# EAGLE design arbotix2 (EAGLE 5.07)
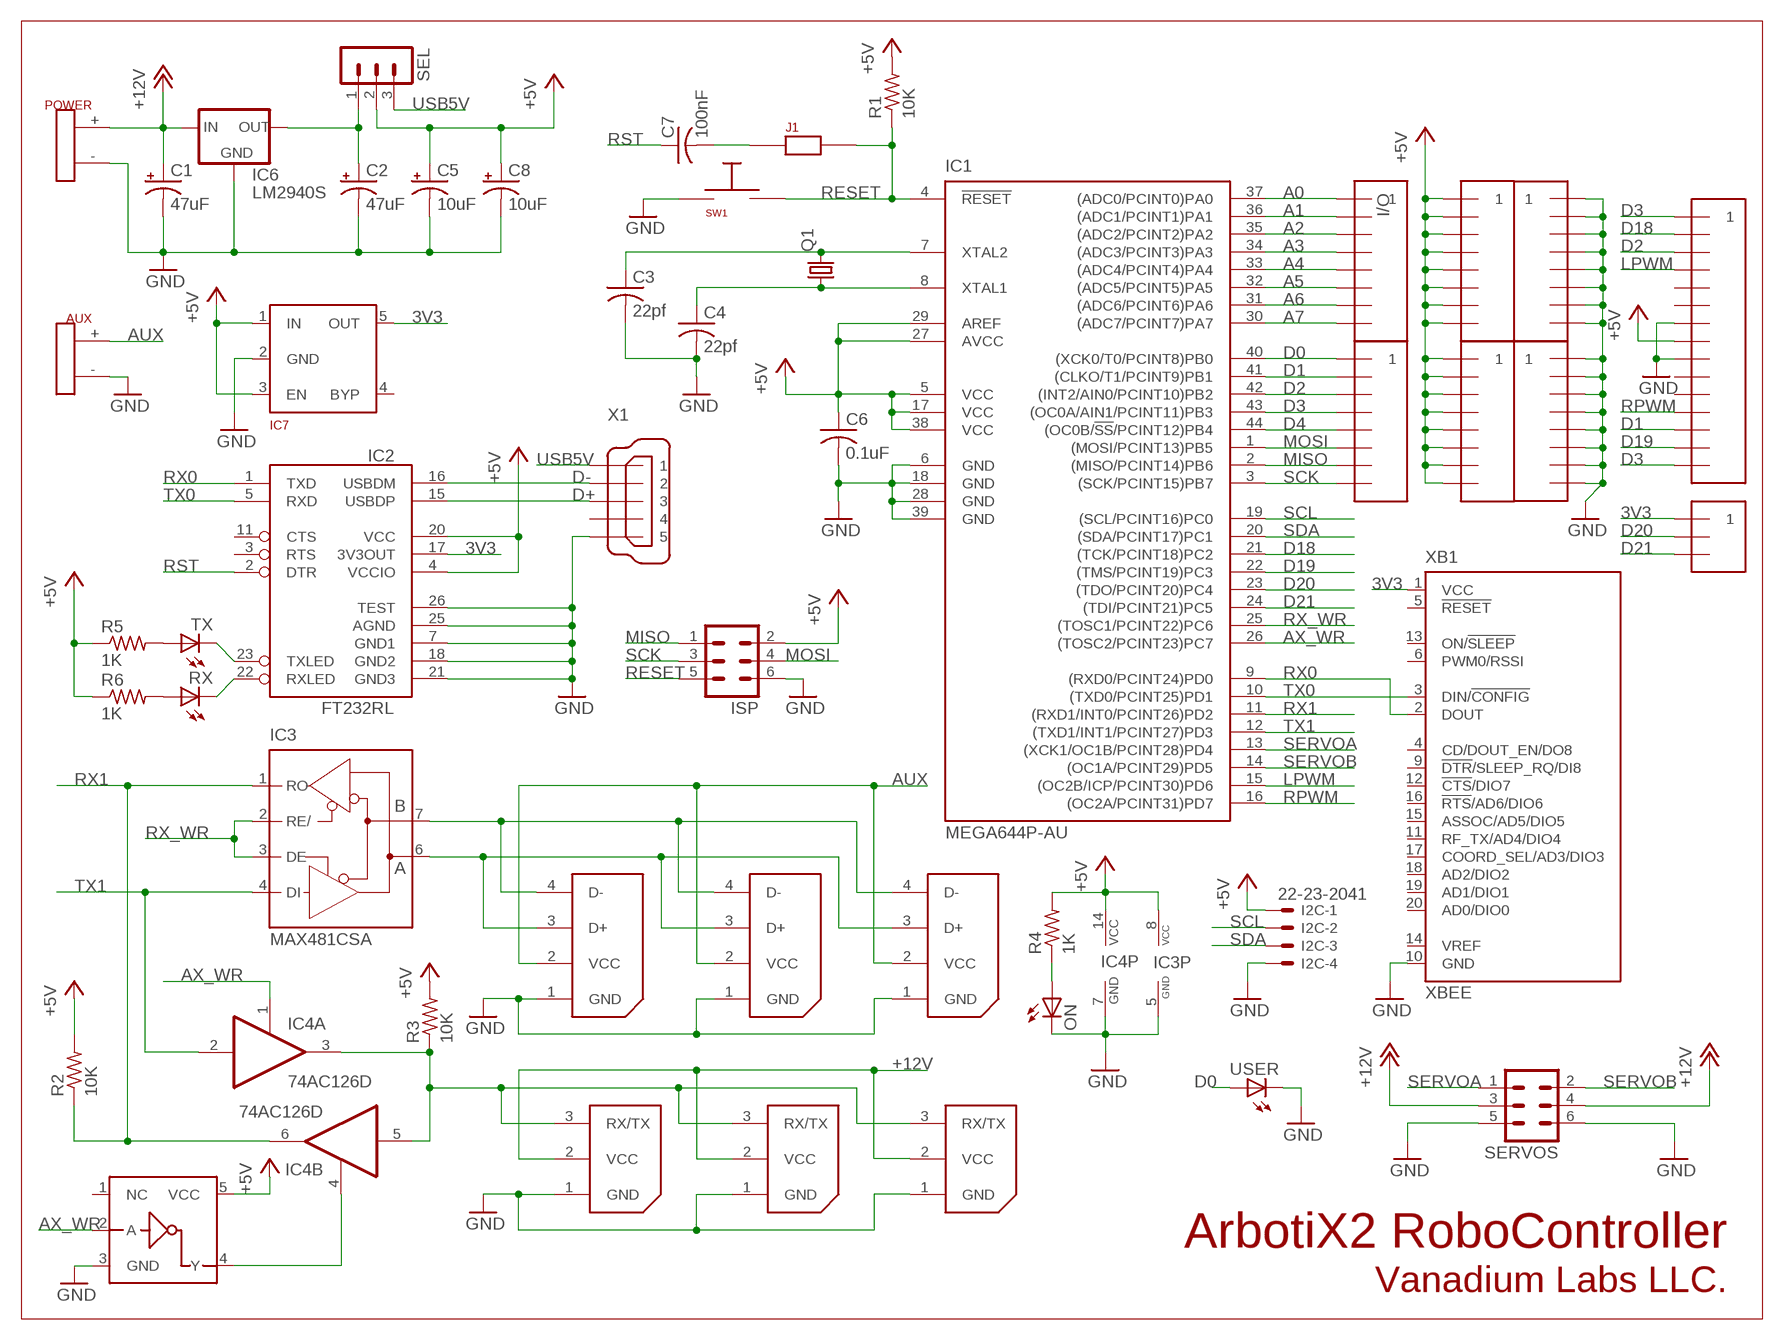
[diagram p0: schematic, sheet 1]

## Parts
AUX  POWER  [POWER]
AX1  WM18887-ND  [BIOLOID]
AX2  WM18887-ND  [BIOLOID]
AX3  WM18887-ND  [BIOLOID]
C1  47uF  CPOL-USTT2D5  [TT2D5]
C2  47uF  CPOL-USTT2D5  [TT2D5]
C3  22pf  C-USC0603  [C0603]
C4  22pf  C-USC0603  [C0603]
C5  10uF  CPOL-USTT2D5  [TT2D5]
C6  0.1uF  C-USC0603  [C0603]
C7  100nF  C-USC0603  [C0603]
C8  10uF  CPOL-USTT2D5  [TT2D5]
I2C  22-23-2041  [22-23-2041]
IC1  MEGA644P-AU  MEGA164P/324P/644P-AU  [TQFP44]
IC2  FT232RL  FT232RL-BASICSSOP  [SSOP28DB]
IC3  MAX481CSA  [SO08]
IC4  74AC126D  [SO14]
IC5  TC7S04F  [SSOP5-0.95]
IC6  LM2940S  [TO220S]
IC7  MIC5205-3.3  [SOT-23-5]
ISP  MA03-2  [MA03-2]
J1  JUMPER  [2-PIN]
ON  LEDCHIP-LED0805  [CHIP-LED0805]
POWER  POWER  [POWER]
Q1  HC49/S  [HC49/S]
R1  10K  R-US_R0805  [R0805]
R2  10K  R-US_R0805  [R0805]
R3  10K  R-US_R0805  [R0805]
R4  1K  R-US_R0805  [R0805]
R5  1K  R-US_R0603  [R0603]
R6  1K  R-US_R0603  [R0603]
RX  LEDCHIP-LED0603  [CHIP-LED0603]
RX1  RX-64  [WM18888-ND]
RX2  RX-64  [WM18888-ND]
RX3  RX-64  [WM18888-ND]
SEL  MA03-1  [MA03-1]
SERVOS  MA03-2  [MA03-2]
SW1  400-1646-ND  [MINISW]
TX  LEDCHIP-LED0603  [CHIP-LED0603]
U$1  HEADER15  [1X15]
U$3  HEADER3  [1X3]
U$5  HEADER8  [1X8]
U$6  HEADER8  [1X8]
U$8  HEADER16  [2X8]
U$9  HEADER16  [2X8]
USER  LEDCHIP-LED0805  [CHIP-LED0805]
X1  MINI-USB-UX60-MB-5ST  [UX60-MB-5ST]
XB1  XBEE  [XBEE]

## Nets
3V3: IC2.17(3V3OUT) IC7.5(OUT) U$3.P$1 XB1.1(VCC)
+5V: C5.+ C6.1 C8.+ I2C.1 IC1.5(VCC) IC1.17(VCC) IC1.27(AVCC) IC1.29(AREF) IC1.38(VCC) IC2.4(VCCIO) IC2.20(VCC) IC3.8(VCC) IC4.14(P:VCC) IC5.5(VCC) IC7.1(IN) IC7.3(EN) ISP.2 R1.2 R2.2 R3.2 R4.2 R5.1 R6.1 SEL.2 U$1.P$8 U$8.P$1 U$8.P$2 U$8.P$3 U$8.P$4 U$8.P$5 U$8.P$6 U$8.P$7 U$8.P$8 U$9.P$1 U$9.P$2 U$9.P$3 U$9.P$4 U$9.P$5 U$9.P$6 U$9.P$7 U$9.P$8
+12V: AX1.2(VCC) AX2.2(VCC) AX3.2(VCC) C1.+ IC6.1(IN) POWER.+ SERVOS.3 SERVOS.4
A0: IC1.37((ADC0/PCINT0)PA0) U$5.P$1
A1: IC1.36((ADC1/PCINT1)PA1) U$5.P$2
A2: IC1.35((ADC2/PCINT2)PA2) U$5.P$3
A3: IC1.34((ADC3/PCINT3)PA3) U$5.P$4
A4: IC1.33((ADC4/PCINT4)PA4) U$5.P$5
A5: IC1.32((ADC5/PCINT5)PA5) U$5.P$6
A6: IC1.31((ADC6/PCINT6)PA6) U$5.P$7
A7: IC1.30((ADC7/PCINT7)PA7) U$5.P$8
AUX: AUX.+ RX1.2(VCC) RX2.2(VCC) RX3.2(VCC)
AX_WR: IC1.26((TOSC2/PCINT23)PC7) IC4.1(A:OE) IC5.2(A)
D0: IC1.40((XCK0/T0/PCINT8)PB0) U$6.P$1 USER.A
D1: IC1.41((CLKO/T1/PCINT9)PB1) U$1.P$13 U$6.P$2
D2: IC1.42((INT2/AIN0/PCINT10)PB2) U$1.P$3 U$6.P$3
D3: IC1.43((OC0A/AIN1/PCINT11)PB3) U$1.P$1 U$1.P$15 U$6.P$4
D4: IC1.44((OC0B/!SS!/PCINT12)PB4) U$6.P$5
D18: IC1.21((TCK/PCINT18)PC2) U$1.P$2
D19: IC1.22((TMS/PCINT19)PC3) U$1.P$14
D20: IC1.23((TDO/PCINT20)PC4) U$3.P$2
D21: IC1.24((TDI/PCINT21)PC5) U$3.P$3
D+: IC2.15(USBDP) X1.3
D-: IC2.16(USBDM) X1.2
GND: AUX.- AX1.1(GND) AX2.1(GND) AX3.1(GND) C1.- C2.- C3.2 C4.2 C5.- C6.2 C8.- I2C.4 IC1.6(GND) IC1.18(GND) IC1.28(GND) IC1.39(GND) IC2.7(GND1) IC2.18(GND2) IC2.21(GND3) IC2.25(AGND) IC2.26(TEST) IC3.5(GND) IC4.7(P:GND) IC5.3(GND) IC6.2(GND) IC7.2(GND) ISP.6 ON.C POWER.- RX1.1(GND) RX2.1(GND) RX3.1(GND) SERVOS.5 SERVOS.6 SW1.2 U$1.P$7 U$1.P$9 U$8.P$9 U$8.P$10 U$8.P$11 U$8.P$12 U$8.P$13 U$8.P$14 U$8.P$15 U$8.P$16 U$9.P$9 U$9.P$10 U$9.P$11 U$9.P$12 U$9.P$13 U$9.P$14 U$9.P$15 U$9.P$16 USER.C X1.5 XB1.10(GND)
LPWM: IC1.15((OC2B/ICP/PCINT30)PD6) U$1.P$4
MISO: IC1.2((MISO/PCINT14)PB6) ISP.1 U$6.P$7
MOSI: IC1.1((MOSI/PCINT13)PB5) ISP.4 U$6.P$6
N$1: C3.1 IC1.7(XTAL2) Q1.2
N$2: IC3.7(B) RX1.4(D-) RX2.4(D-) RX3.4(D-)
N$3: AX1.3(RX/TX) AX2.3(RX/TX) AX3.3(RX/TX) IC4.3(A:O) IC4.5(B:I) R3.1
N$4: C4.1 IC1.8(XTAL1) Q1.1
N$7: C7.2 J1.P$1
N$8: IC4.4(B:OE) IC5.4(Y)
N$10: R6.2 RX.A
N$11: R5.2 TX.A
N$12: IC3.6(A) RX1.3(D+) RX2.3(D+) RX3.3(D+)
N$17: C2.+ IC6.3(OUT) SEL.1
N$44: IC2.23(TXLED) TX.C
N$45: IC2.22(RXLED) RX.C
N$47: ON.A R4.1
RESET: IC1.4(!RESET) ISP.5 J1.P$2 R1.1 SW1.1
RPWM: IC1.16((OC2A/PCINT31)PD7) U$1.P$12
RST: C7.1 IC2.2(DTR)
RX0: IC1.9((RXD0/PCINT24)PD0) IC2.1(TXD) XB1.2(DOUT)
RX1: IC1.11((RXD1/INT0/PCINT26)PD2) IC3.1(RO) IC4.6(B:O) R2.1
RX_WR: IC1.25((TOSC1/PCINT22)PC6) IC3.2(RE/) IC3.3(DE)
SCK: IC1.3((SCK/PCINT15)PB7) ISP.3 U$6.P$8
SCL: I2C.2 IC1.19((SCL/PCINT16)PC0)
SDA: I2C.3 IC1.20((SDA/PCINT17)PC1)
SERVOA: IC1.13((XCK1/OC1B/PCINT28)PD4) SERVOS.1
SERVOB: IC1.14((OC1A/PCINT29)PD5) SERVOS.2
TX0: IC1.10((TXD0/PCINT25)PD1) IC2.5(RXD) XB1.3(DIN/!CONFIG)
TX1: IC1.12((TXD1/INT1/PCINT27)PD3) IC3.4(DI) IC4.2(A:I)
USB5V: SEL.3 X1.1
Unconnected: IC2.3(RTS) IC2.11(CTS) IC4.8(C:O) IC4.9(C:I) IC4.10(C:OE) IC4.11(D:O) IC4.12(D:I) IC4.13(D:OE) IC5.1(NC) IC7.4(BYP) U$1.P$5 U$1.P$6 U$1.P$10 U$1.P$11 X1.4 XB1.4(CD/DOUT_EN/DO8) XB1.5(!RESET) XB1.6(PWM0/RSSI) XB1.9(!DTR!/SLEEP_RQ/DI8) XB1.11(RF_TX/AD4/DIO4) XB1.12(!CTS!/DIO7) XB1.13(ON/!SLEEP) XB1.14(VREF) XB1.15(ASSOC/AD5/DIO5) XB1.16(!RTS!/AD6/DIO6) XB1.17(COORD_SEL/AD3/DIO3) XB1.18(AD2/DIO2) XB1.19(AD1/DIO1) XB1.20(AD0/DIO0)

## Notes on the sheet
- I/O
- ArbotiX2 RoboController
- Vanadium Labs LLC.

## Library data of the parts
AUX POWER = robots:POWER
AX1-AX3 = robots:WM18887-ND: Bioloid Bus Header Digikey Part No: WM18887-ND Molex/Waldom Electronics Corp 22-03-5035
C1 C2 C5 C8 = rcl:CPOL-US: POLARIZED CAPACITOR, American symbol
C3 C4 C6 C7 = rcl:C-US: CAPACITOR, American symbol
I2C = con-molex:22-23-2041: .100" (2.54mm) Center Header - 4 Pin
IC1 = avr:MEGA164P/324P/644P-AU
IC2 = SparkFun:FT232RL-BASIC: USB UART This is the simplified version of the FT232RL unit. Only what you need, nothing you don't. Spark Fun Electronics SKU : COM-00650
IC3 = maxim:MAX481CSA: RS485 TRANSEIVER
IC4 = 74xx-eu:74*126: Quad bus BUFFER, 3-state
IC5 = robots:TC7S04F
IC6 = robots:LM2940: LM2940 LDO REGULATOR
IC7 = robots:MIC5205-3.3
ISP SERVOS = con-lstb:MA03-2: PIN HEADER
J1 = robots:JUMPER
ON RX TX USER = led:LED: LED OSRAM: - CHIPLED LG R971, LG N971, LY N971, LG Q971, LY Q971, LO R971, LY R971 LH N974, LH R974 LS Q976, LO Q976, LY Q976 LO Q996 - Hyper CHIPLED LW Q18S LB Q993, LB Q99A, LB R99A - SideLED LS A670, LO A670, LY A670, LG A670, LP A670 LB A673, LV A673, LT A673, LW A673 LH A674 LY A675 LS A676, LA A676, LO A676, LY A676, LW A676 LS A679, LY A679, LG A679 - Hyper Micro SIDELED® LS Y876, LA Y876, LO Y876, LY Y876 LT Y87S - SmartLED LW L88C, LW L88S LB L89C, LB L89S, LG L890 LS L89K, LO L89K, LY L89K LS L896, LA L896, LO L896, LY L896 - TOPLED LS T670, LO T670, LY T670, LG T670, LP T670 LSG T670, LSP T670, LSY T670, LOP T670, LYG T670 LG T671, LOG T671, LSG T671 LB T673, LV T673, LT T673, LW T673 LH T674 LS T676, LA T676, LO T676, LY T676, LB T676, LH T676, LSB T676, LW T676 LB T67C, LV T67C, LT T67C, LS T67K, LO T67K, LY T67K, LW E67C LS E67B, LA E67B, LO E67B, LY E67B, LB E67C, LV E67C, LT E67C LW T67C LS T679, LY T679, LG T679 LS T770, LO T770, LY T770, LG T770, LP T770 LB T773, LV T773, LT T773, LW T773 LH T774 LS E675, LA E675, LY E675, LS T675 LS T776, LA T776, LO T776, LY T776, LB T776 LHGB T686 LT T68C, LB T68C - Hyper Mini TOPLED® LB M676 - Mini TOPLED Santana® LG M470 LS M47K, LO M47K, LY M47K Source: http://www.osram.convergy.de LUXEON: - LUMILED® LXK2-PW12-R00, LXK2-PW12-S00, LXK2-PW14-U00, LXK2-PW14-V00 LXK2-PM12-R00, LXK2-PM12-S00, LXK2-PM14-U00 LXK2-PE12-Q00, LXK2-PE12-R00, LXK2-PE12-S00, LXK2-PE14-T00, LXK2-PE14-U00 LXK2-PB12-K00, LXK2-PB12-L00, LXK2-PB12-M00, LXK2-PB14-N00, LXK2-PB14-P00, LXK2-PB14-Q00 LXK2-PR12-L00, LXK2-PR12-M00, LXK2-PR14-Q00, LXK2-PR14-R00 LXK2-PD12-Q00, LXK2-PD12-R00, LXK2-PD12-S00 LXK2-PH12-R00, LXK2-PH12-S00 LXK2-PL12-P00, LXK2-PL12-Q00, LXK2-PL12-R00 Source: www.luxeon.com KINGBRIGHT: KA-3528ASYC Source: www.kingbright.com
Q1 = crystal:HC49/S: CRYSTAL
R1-R6 = rcl:R-US_: RESISTOR, American symbol
RX1-RX3 = robots:RX-64
SEL = con-lstb:MA03-1: PIN HEADER
SW1 = robots:400-1646-ND: Mini Switch
U$1 = robots:HEADER15
U$3 = robots:HEADER3
U$5 U$6 = robots:HEADER8
U$8 U$9 = robots:HEADER16
X1 = con-hirose:MINI-USB-: MINI USB Connector Source: http://www.hirose.co.jp/cataloge_hp/e24000019.pdf
XB1 = maxstream:XBEE: XBee (TM) /XBee-PRO(TM) OEM RF Modules Source: MaxStream, Inc. xbee_productmanual.pdf

## Board
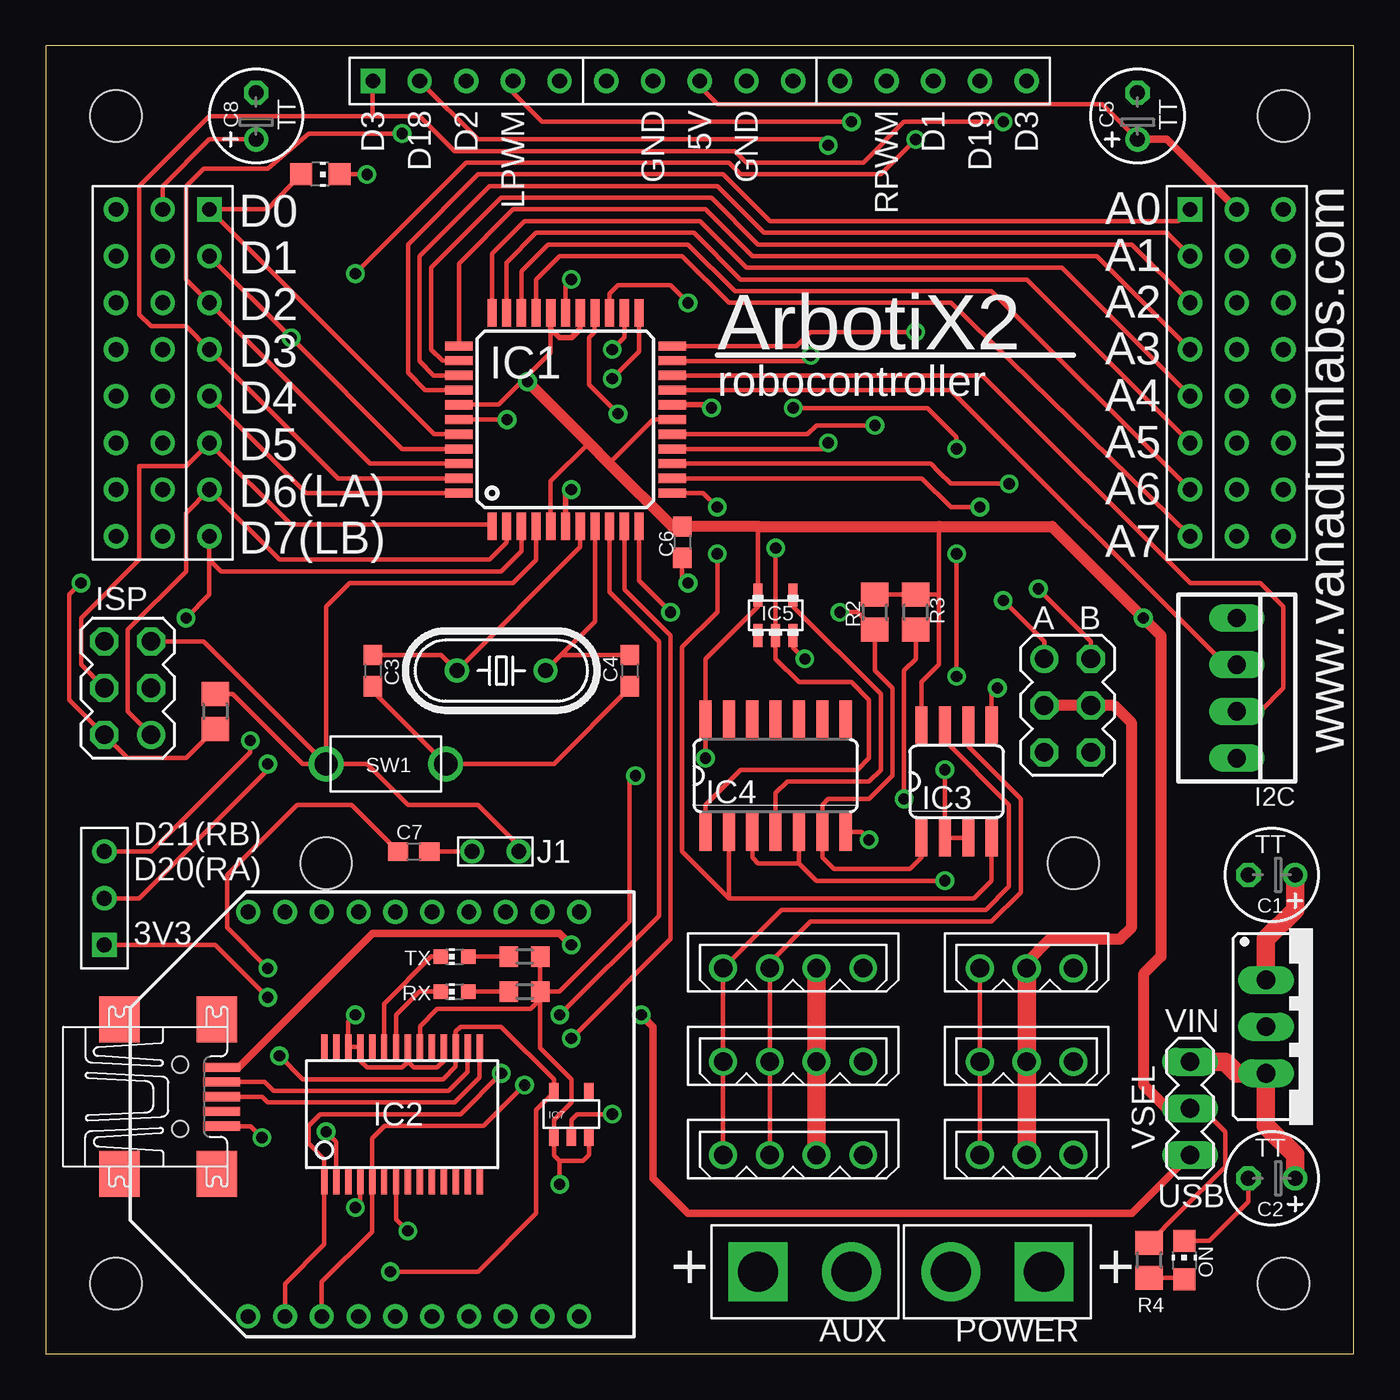
[diagram p1: board, top side]
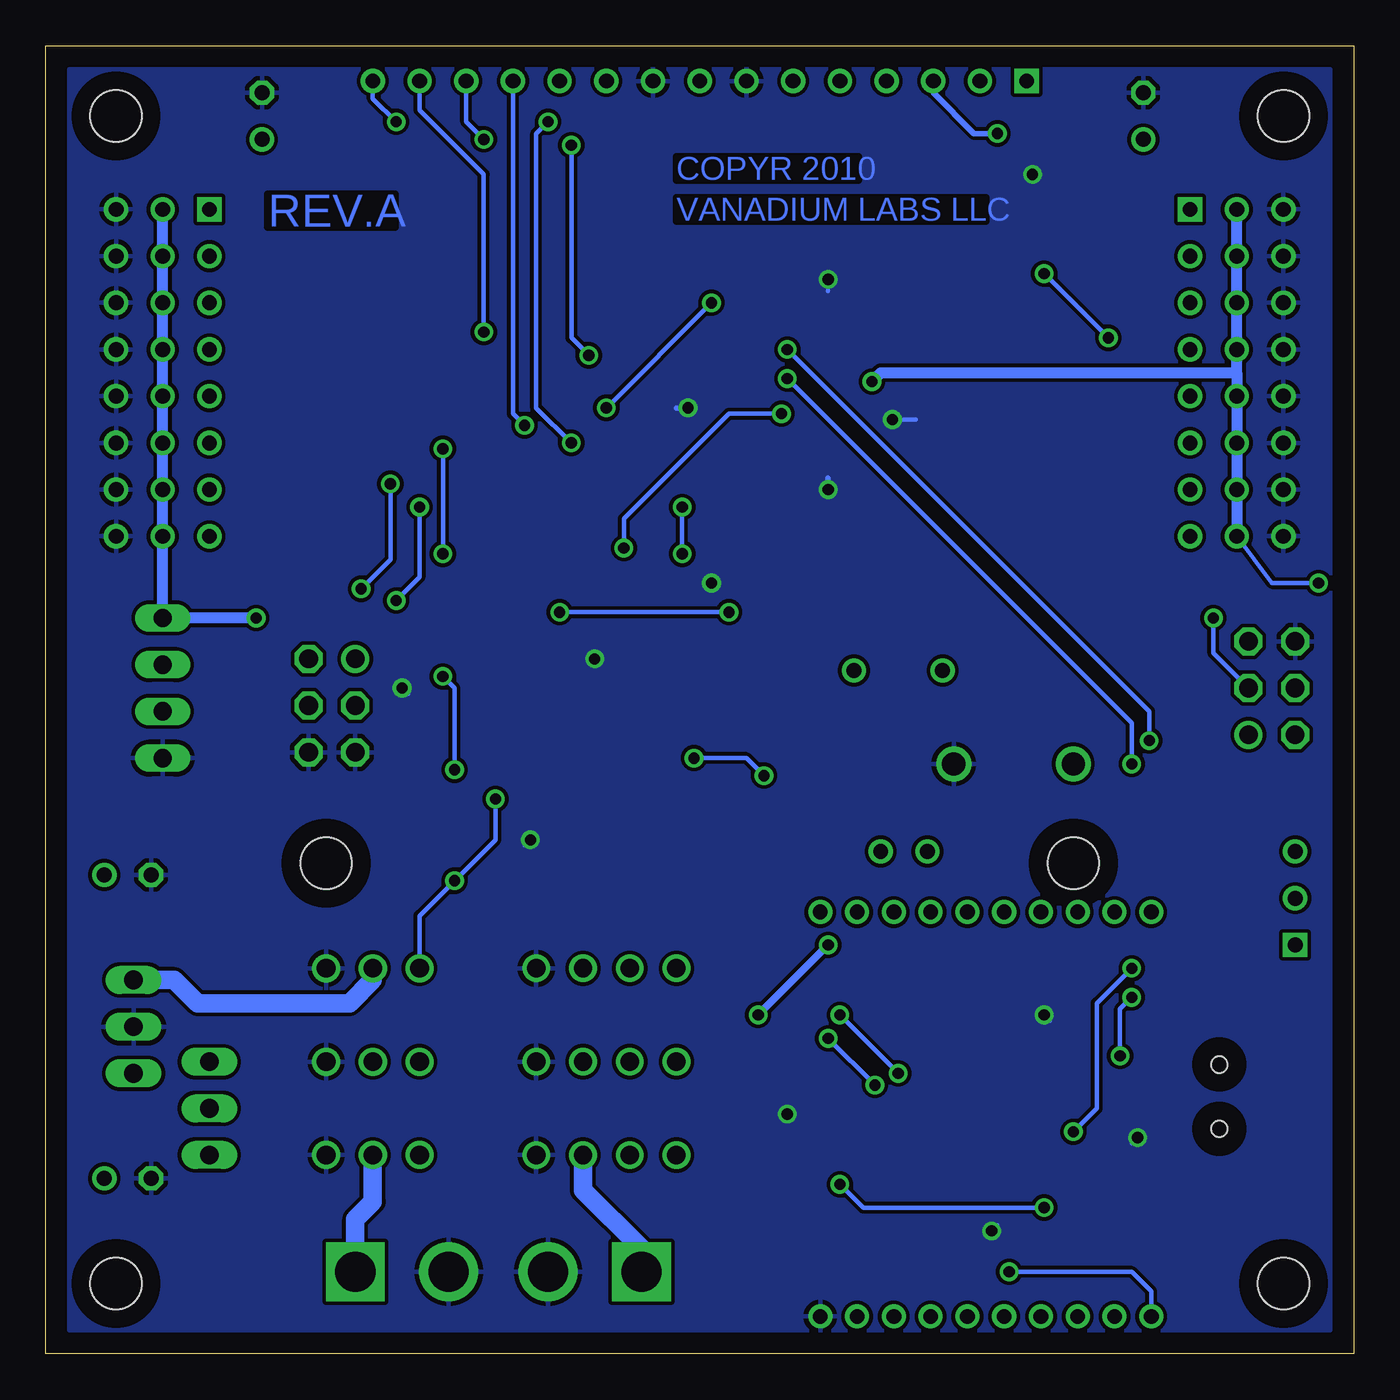
[diagram p2: board, bottom side, seen from below]

Size 71.12 x 71.12 mm. Coordinates in mm from the lower left corner, seen from the top.
Outline: 0,0 71.12,0 71.12,71.12 0,71.12 0,0
Copper layers (1*16): Top 0.035mm / dielectric 1.5mm / Bottom 0.035mm
Design rules "default *": minimum track width 8mil, minimum drill 24mil, track to track 8mil, track to pad 8mil, pad to pad 8mil, via to via 8mil, smd to smd 8mil, copper to edge 40mil, drill to drill 8mil, minimum pad ring 10mil, minimum via ring 8mil, stop-mask expansion 4mil, vias tented up to drill 24mil, thermal gap 10mil
Holes 2.79 mm at 67.31,3.81 3.81,3.81 3.81,67.31 67.31,67.31
Holes 2.8 mm at 15.24,26.67 55.88,26.67

### Footprints (pad centres in the part's own frame; a part is rotated, then mirrored left to right if it is on the bottom)
POWER = drill 2.184 square: + 0,0 | drill 2.184 round: - 5.08,0
BIOLOID = drill 1.016 round: 1 0,0; 2 2.54,0; 3 5.08,0
TT2D5 = drill 0.813 round: + -1.27,0 | drill 0.813 octagon: - 1.27,0
C0603 = smd 1.1 x 1: 1 -0.85,0; 2 0.85,0
22-23-2041 = drill 1 long: 1 -3.81,0; 2 -1.27,0; 3 1.27,0; 4 3.81,0
TQFP44 = smd 1.5 x 0.5: 1 -5.8,4; 2 -5.8,3.2; 3 -5.8,2.4; 4 -5.8,1.6; 5 -5.8,0.8; 6 -5.8,0; 7 -5.8,-0.8; 8 -5.8,-1.6; 9 -5.8,-2.4; 10 -5.8,-3.2; 11 -5.8,-4; 23 5.8,-4; 24 5.8,-3.2; 25 5.8,-2.4; 26 5.8,-1.6; 27 5.8,-0.8; 28 5.8,0; 29 5.8,0.8; 30 5.8,1.6; 31 5.8,2.4; 32 5.8,3.2; 33 5.8,4 | smd 0.5 x 1.5: 12 -4,-5.8; 13 -3.2,-5.8; 14 -2.4,-5.8; 15 -1.6,-5.8; 16 -0.8,-5.8; 17 0,-5.8; 18 0.8,-5.8; 19 1.6,-5.8; 20 2.4,-5.8; 21 3.2,-5.8; 22 4,-5.8; 34 4,5.8; 35 3.2,5.8; 36 2.4,5.8; 37 1.6,5.8; 38 0.8,5.8; 39 0,5.8; 40 -0.8,5.8; 41 -1.6,5.8; 42 -2.4,5.8; 43 -3.2,5.8; 44 -4,5.8
SSOP28DB = smd 0.348 x 1.397: 1 -4.225,-3.656; 2 -3.575,-3.656; 3 -2.925,-3.656; 4 -2.275,-3.656; 5 -1.625,-3.656; 6 -0.975,-3.656; 7 -0.325,-3.656; 8 0.325,-3.656; 9 0.975,-3.656; 10 1.625,-3.656; 11 2.275,-3.656; 12 2.925,-3.656; 13 3.575,-3.656; 14 4.225,-3.656; 15 4.225,3.656; 16 3.575,3.656; 17 2.925,3.656; 18 2.275,3.656; 19 1.625,3.656; 20 0.975,3.656; 21 0.325,3.656; 22 -0.325,3.656; 23 -0.975,3.656; 24 -1.625,3.656; 25 -2.275,3.656; 26 -2.925,3.656; 27 -3.575,3.656; 28 -4.225,3.656
SO08 = smd 0.66 x 2.032: 1 -1.905,-3.073; 2 -0.635,-3.073; 3 0.635,-3.073; 4 1.905,-3.073; 5 1.905,3.073; 6 0.635,3.073; 7 -0.635,3.073; 8 -1.905,3.073
SO14 = smd 0.66 x 2.032: 1 -3.81,-3.073; 2 -2.54,-3.073; 3 -1.27,-3.073; 4 0,-3.073; 5 1.27,-3.073; 6 2.54,-3.073; 7 3.81,-3.073; 8 3.81,3.073; 9 2.54,3.073; 10 1.27,3.073; 11 0,3.073; 12 -1.27,3.073; 13 -2.54,3.073; 14 -3.81,3.073
SSOP5-0.95 = smd 1.27 x 0.5: 1 0,0; 2 0,-0.95; 3 0,-1.9; 4 2.2,-1.9; 5 2.2,0
TO220S = drill 1.016 long: 1 -2.54,1.27; 2 0,1.27; 3 2.54,1.27
SOT-23-5 = smd 0.508 x 1.016: 1 -0.95,-1.2; 2 0,-1.2; 3 0.95,-1.2; 4 0.95,1.2; 5 -0.95,1.2
MA03-2 = drill 1.016 round: 1 -2.54,-1.27 | drill 1.016 octagon: 2 -2.54,1.27; 3 0,-1.27; 4 0,1.27; 5 2.54,-1.27; 6 2.54,1.27
2-PIN = drill 0.813 round: P$1 -1.27,0; P$2 1.27,0
CHIP-LED0805 = smd 1.2 x 1.2: A 0,-1.05; C 0,1.05
HC49/S = drill 0.813 round: 1 -2.413,0; 2 2.413,0
R0805 = smd 1.3 x 1.5: 1 -0.95,0; 2 0.95,0
R0603 = smd 1 x 1.1: 1 -0.85,0; 2 0.85,0
CHIP-LED0603 = smd 0.8 x 0.8: A 0,-0.75; C 0,0.75
WM18888-ND = drill 1 round: 1 0,0; 2 -2.54,0; 3 -5.08,0; 4 -7.62,0
MA03-1 = drill 1.016 long: 1 -2.54,0; 2 0,0; 3 2.54,0
MINISW = drill 1.27 round: 1 0,0; 2 6.5,0
1X15 = drill 0.813 square: P$1 0,0 | drill 0.813 round: P$2 2.54,0; P$3 5.08,0; P$4 7.62,0; P$5 10.16,0; P$6 12.7,0; P$7 15.24,0; P$8 17.78,0; P$9 20.32,0; P$10 22.86,0; P$11 25.4,0; P$12 27.94,0; P$13 30.48,0; P$14 33.02,0; P$15 35.56,0
1X3 = drill 0.813 square: P$1 0,0 | drill 0.813 round: P$2 2.54,0; P$3 5.08,0
1X8 = drill 0.813 square: P$1 0,0 | drill 0.813 round: P$2 2.54,0; P$3 5.08,0; P$4 7.62,0; P$5 10.16,0; P$6 12.7,0; P$7 15.24,0; P$8 17.78,0
2X8 = drill 0.813 round: P$1 0,0; P$2 2.54,0; P$3 5.08,0; P$4 7.62,0; P$5 10.16,0; P$6 12.7,0; P$7 15.24,0; P$8 17.78,0; P$9 0,2.54; P$10 2.54,2.54; P$11 5.08,2.54; P$12 7.62,2.54; P$13 10.16,2.54; P$14 12.7,2.54; P$15 15.24,2.54; P$16 17.78,2.54
UX60-MB-5ST = smd 2 x 0.5: 1 2.25,1.6; 2 2.25,0.8; 3 2.25,0; 4 2.25,-0.8; 5 2.25,-1.6 | smd 2.2 x 2.5: M1 -3.3,-4.2; M2 -3.3,4.2; M3 2,4.2; M4 2,-4.2 | hole 0.9: 0,-1.75; 0,1.75
XBEE = drill 0.8 pad 1.27 round: 1 -11,9; 2 -11,7; 3 -11,5; 4 -11,3; 5 -11,1; 6 -11,-1; 7 -11,-3; 8 -11,-5; 9 -11,-7; 10 -11,-9; 11 11,-9; 12 11,-7; 13 11,-5; 14 11,-3; 15 11,-1; 16 11,1; 17 11,3; 18 11,5; 19 11,7; 20 11,9

### Placement (x,y rotation side)
AUX  38.73,4.45 0 top
AX1  55.88,15.88 180 top
AX2  55.88,10.79 180 top
AX3  55.88,20.95 180 top
C1  66.67,26.04 180 top
C2  66.67,9.53 180 top
C3  17.78,37.15 270 top
C4  31.75,37.15 270 top
C5  59.37,67.31 90 top
C6  34.61,44.13 270 top
C7  20,27.3 0 top
C8  11.43,67.31 90 top
I2C  64.77,36.2 270 top
IC1  28.26,50.8 90 top
IC2  19.37,13.02 0 top
IC3  49.53,31.11 0 top
IC4  39.69,31.43 0 top
IC5  38.73,39.05 90 top
IC6  65.09,17.78 270 top
IC7  28.57,13.02 0 top
ISP  4.45,36.2 90 top
J1  24.45,27.3 0 top
ON  61.91,5.08 0 top
POWER  54.29,4.45 180 top
Q1  24.77,37.15 180 top
R1  9.21,34.92 270 top
R2  45.09,40.32 90 top
R3  47.31,40.32 90 top
R4  60.01,5.08 90 top
R5  26.04,21.59 180 top
R6  26.04,19.68 180 top
RX  22.23,19.68 90 top
RX1  44.45,20.95 0 top
RX2  44.45,15.88 0 top
RX3  44.45,10.79 0 top
SEL  62.23,13.34 270 top
SERVOS  55.56,35.24 270 top
SW1  15.24,32.07 0 top
TX  22.23,21.59 90 top
U$1  17.78,69.22 0 top
U$3  3.17,22.23 90 top
U$5  62.23,62.23 270 top
U$6  8.89,62.23 270 top
U$8  6.35,44.45 90 top
U$9  64.77,62.23 270 top
USER  14.92,64.14 270 top
X1  7.3,13.97 0 top
XB1  20,13.02 90 top

### Tracks (layer width: path | path; a pad name or v marks a point on that pad's centre or on a via)
3V3  (via drill 0.61)
  Top 0.254: v18.73,4.45 23.5,4.45 26.67,7.62 26.67,13.26 IC7.5 27.62,14.92 24.77,17.78 22.54,17.78 22.29,17.53 IC2.17 22.29,15.62 21.59,14.92 13.97,14.92 v12.7,16.19 | U$3.P$1 9.21,22.23 v12.06,19.37
  Bottom 0.254: XB1.1 11,3.38 12.06,4.45 v18.73,4.45 | v12.7,16.19 12.7,18.73 v12.06,19.37
+5V  (via drill 0.61)
  Top 0.254: R1.2 7.62,32.38 4.45,32.38 ISP.2 1.27,35.56 1.27,41.27 v1.91,41.91 | IC3.8 47.62,36.51 48.58,37.47 48.58,41.27 | 26.89,19.27 26.89,16.61 28.58,14.92 28.57,13.65 27.62,12.7 IC7.1 27.62,10.79 27.94,10.48 | 26.89,19.27 R6.1 R5.1 | IC2.20 20.34,17.8 21.27,18.73 26.35,18.73 26.89,19.27 | 27.94,10.48 29.21,10.48 29.53,10.79 IC7.3 | IC2.4 17.09,8.2 v16.83,7.94 | v27.94,9.21 27.94,10.48 | U$1.P$8 35.56,68.9 36.51,67.94 57.47,67.94 C5.+ | SEL.2 62.87,13.34 64.14,12.06 64.14,10.16 61.59,7.62 R4.2 | 26.89,19.27 27.3,19.68 27.94,19.68 31.75,23.5 31.75,31.11 v32.07,31.43 | IC5.5 38.73,44.98 | IC5.5 38.73,41.27 | v35.88,32.38 IC4.14 35.88,37.78 38.73,40.64 IC5.5 | IC1.17 33.02,50.8 30.64,48.42 | IC1.5 27.46,47.46 29.53,49.53 | IC1.38 24.61,51.6 26.04,53.02 27.46,54.45 27.46,55.73 | 48.58,44.98 48.58,41.27 | R2.2 R3.2 46.99,41.27 48.58,41.27 | U$8.P$8 6.35,63.5 8.89,66.04 C8.+
  Top 0.305: IC1.29 27.46,55.73 27.94,55.24 28.57,55.24 29.06,55.73 IC1.27
  Top 0.406: U$9.P$1 60.96,66.04 C5.+
  Top 0.61: SEL.2 60.96,13.34 59.69,14.61 59.69,20.64 60.64,21.59 60.64,39.05 v59.69,40.01 54.71,44.98 48.58,44.98 38.73,44.98 C6.1 34.08,44.98 30.64,48.42 29.53,49.53 v26.19,52.86 26.04,53.02
  Bottom 0.254: v1.91,41.91 4.45,41.91 U$8.P$1 | v16.83,7.94 26.67,7.94 v27.94,9.21 | v35.88,32.38 33.02,32.38 v32.07,31.43
  Bottom 0.61: U$9.P$1 U$9.P$2 U$9.P$3 U$9.P$4 U$9.P$5 U$9.P$6 U$9.P$7 U$9.P$8 I2C.1 v59.69,40.01 | U$8.P$8 U$8.P$7 U$8.P$6 U$8.P$5 6.35,53.34 | U$8.P$1 U$8.P$2 U$8.P$3 U$8.P$4 6.35,53.34 | 6.35,53.34 25.72,53.34 v26.19,52.86
+12V
  Top 0.61: SERVOS.3 SERVOS.4 58.1,35.24 59.05,34.29 59.05,23.18 58.42,22.54 54.61,22.54 53.34,21.27 AX3.2
  Top 1.016: AX2.2 AX1.2 AX3.2 | IC6.1 66.36,22.54 67.94,24.13 C1.+
  Bottom 1.016: POWER.+ 54.29,7.3 53.34,8.26 AX2.2 | IC6.1 64.14,20.32 62.87,19.05 54.61,19.05 53.34,20.32 AX3.2
A0
  Top 0.254: IC1.37 20.62,52.4 19.68,53.34 19.68,60.33 23.5,64.14 36.83,64.14 39.37,61.59 61.59,61.59 U$5.P$1
A1
  Top 0.254: IC1.36 21.09,53.2 20.32,53.98 20.32,59.69 24.13,63.5 36.51,63.5 39.05,60.96 60.96,60.96 U$5.P$2
A2
  Top 0.254: IC1.35 21.57,54 20.95,54.61 20.95,59.05 24.77,62.87 36.2,62.87 38.73,60.33 59.05,60.33 U$5.P$3
A3
  Top 0.254: IC1.34 22.46,59.29 25.4,62.23 35.88,62.23 38.42,59.69 57.15,59.69 U$5.P$4
A4
  Top 0.254: IC1.33 24.26,59.82 26.04,61.59 35.56,61.59 38.1,59.05 55.24,59.05 U$5.P$5
A5
  Top 0.254: IC1.32 25.06,59.35 26.67,60.96 35.24,60.96 37.78,58.42 53.34,58.42 U$5.P$6
A6
  Top 0.254: IC1.31 25.86,58.88 27.3,60.33 34.92,60.33 37.47,57.78 51.44,57.78 U$5.P$7
A7
  Top 0.254: IC1.30 26.66,58.41 27.94,59.69 34.61,59.69 37.15,57.15 49.21,57.15 U$5.P$8
AUX
  Top 1.016: RX3.2 RX2.2 RX1.2
  Bottom 1.016: AUX.+ 38.73,5.71 41.91,8.89 RX3.2
AX_WR  (via drill 0.61)
  Top 0.254: IC4.1 35.88,29.84 37.78,31.75 44.13,31.75 44.77,32.38 44.77,35.56 43.81,36.51 40.96,36.51 39.69,37.78 39.69,38.41 IC5.2 v39.69,43.81 | v31.11,51.12 29.53,52.7 29.53,55.24 29.84,55.56 29.84,56.59 IC1.26
  Bottom 0.254: v39.69,43.81 39.69,45.4 33.97,51.12 v31.11,51.12
D0
  Top 0.254: IC1.40 21.12,50 U$6.P$1 12.06,62.23 USER.A
D1  (via drill 0.61)
  Top 0.254: IC1.41 19.38,49.2 v13.34,55.24 U$6.P$2 | v47.31,66.04 45.4,64.14 37.78,64.14 37.15,64.77 22.86,64.77 v16.83,58.74
  Bottom 0.254: v47.31,66.04 48.26,66.99 U$1.P$13 | v13.34,55.24 v16.83,58.74
D2  (via drill 0.61)
  Top 0.254: IC1.42 17.64,48.4 U$6.P$3 7.62,58.42 7.62,63.5 8.57,64.45 12.06,64.45 14.29,66.36 v19.37,66.36
  Bottom 0.305: U$1.P$3 22.86,68.58 20.64,66.36 v19.37,66.36
D3  (via drill 0.61)
  Top 0.254: IC1.43 15.9,47.6 U$6.P$4 7.62,55.88 5.71,55.88 5.08,56.52 5.08,63.5 8.89,67.31 17.78,67.31 | v52.07,66.99 46.67,66.99 44.45,64.77 38.1,64.77 37.47,65.41 22.23,65.41 20.32,67.31 17.78,67.31 | 17.78,67.31 U$1.P$1
  Bottom 0.254: U$1.P$15 53.34,68.26 v52.07,66.99
D4
  Top 0.254: IC1.44 14.16,46.8 U$6.P$5
D18  (via drill 0.61)
  Top 0.254: U$1.P$2 23.5,66.04 42.23,66.04 v42.55,65.72 | v41.59,54.29 41.27,53.98 34.08,53.98 IC1.21
  Bottom 0.254: v42.55,65.72 42.55,55.24 v41.59,54.29
D19  (via drill 0.61)
  Top 0.254: IC1.22 40.83,54.8 41.59,55.56 v47.31,55.56
  Bottom 0.254: U$1.P$14 50.8,67.63 47.31,64.14 v47.31,55.56
D20  (via drill 0.61)
  Top 0.254: U$3.P$2 5.08,24.77 12.06,31.75 v12.06,32.07 | IC1.23 32.26,54.48 v30.8,53.02
  Bottom 0.254: v30.8,53.02 12.06,34.29 v12.06,32.07
D21  (via drill 0.61)
  Top 0.254: U$3.P$3 5.71,27.3 11.11,32.7 v11.11,33.34 | IC1.24 31.46,55.27 v30.8,54.61
  Bottom 0.254: v30.8,54.61 11.11,34.92 v11.11,33.34
D+
  Top 0.254: X1.3 11.75,13.97 12.06,13.65 22.23,13.65 23.59,15.02 IC2.15
D-
  Top 0.254: X1.2 11.9,14.77 12.38,14.29 21.91,14.29 22.94,15.32 IC2.16
GND  (via drill 0.61)
  Top 0.254: C3.2 17.78,36.03 SW1.2 27.62,32.07 31.75,36.2 C4.2 | X1.5 11.12,12.37 v11.75,11.75 | IC4.7 44.35,28.36 v44.77,27.94 | USER.C v17.46,64.14 | IC2.7 19.04,7.31 v19.68,6.67 | IC7.2 28.57,12.7 28.89,13.02 v30.8,13.02 | 19.68,15.88 19.37,15.56 17.46,15.56 17.09,15.93 IC2.25 IC2.26 16.44,18.03 v16.83,18.41 | 19.68,15.88 IC2.21 | IC2.18 21.64,15.93 21.27,15.56 20,15.56 19.68,15.88 | ON.C 63.28,6.13 65.41,8.26 C2.- | IC1.28 28.26,58.1 v28.57,58.42 | IC1.39 v25.08,50.8 | IC3.5 51.44,35.88 v51.75,36.2 | IC5.3 40.63,38.41 v41.27,37.78 | C6.2 34.61,42.23 v34.92,41.91
  Top 0.305: IC1.18 36.03,51.6 v36.2,51.44 | IC1.6 28.26,46.67 v28.57,46.99
  Bottom 0.254: v11.75,11.75 12.06,11.43 | 45.09,27.62 v44.77,27.94 | v17.46,64.14 17.78,64.14 | v19.68,6.67 19.37,6.99 | v30.8,13.02 30.48,13.02 | v16.83,18.41 16.51,18.1 | v28.57,58.42 28.57,57.78 | v25.08,50.8 23.81,50.8 | v51.75,36.2 51.44,35.88
  Bottom 0.305: v36.2,51.44 36.83,51.44 | v28.57,46.99 28.57,47.62
  pour Bottom: 1.27,69.85 1.27,1.27 69.85,1.27 69.85,69.85
LPWM  (via drill 0.61)
  Top 0.254: U$1.P$4 25.4,68.58 26.99,66.99 v43.81,66.99 | IC1.15 42.22,49.2 v42.55,49.53
  Bottom 0.254: v43.81,66.99 44.45,66.36 44.45,51.44 v42.55,49.53
MISO
  Top 0.254: IC1.2 25.06,44.11 24.13,43.18 12.7,43.18 U$6.P$7 7.62,45.72 7.62,42.55 4.45,39.37 4.45,34.92 ISP.1
MOSI
  Top 0.254: ISP.4 1.91,37.47 1.91,40.01 5.08,43.18 5.08,48.26 7.62,48.26 U$6.P$6 13.34,45.09 24.17,45.09 IC1.1
N$1
  Top 0.254: C3.1 21.5,38 Q1.2 29.06,43.85 IC1.7
N$2
  Top 0.254: RX3.4 RX2.4 RX1.4 40.01,24.13 51.12,24.13 52.39,25.4 52.39,29.84 48.9,33.34 IC3.7
N$3  (via drill 0.61)
  Top 0.254: AX2.3 AX1.3 AX3.3 | v48.9,25.72 41.91,25.72 40.96,26.67 | 40.96,26.67 IC4.5 | IC4.3 38.42,26.99 38.73,26.67 40.96,26.67 | R3.1 47.31,37.78 46.67,37.15 v46.67,30.16
  Bottom 0.254: AX3.3 50.8,23.81 v48.9,25.72 46.67,27.94 v46.67,30.16
N$4
  Top 0.254: 28.03,38 C4.1 | Q1.1 28.03,38 | IC1.8 29.86,39.83 28.03,38
N$7
  Top 0.254: C7.2 J1.P$1
N$8
  Top 0.254: IC4.4 39.69,30.48 40.32,31.11 44.77,31.11 45.4,31.75 45.4,35.88 40.64,40.64 IC5.4
N$10
  Top 0.254: RX.A R6.2
N$11
  Top 0.254: TX.A R5.2
N$12
  Top 0.254: RX3.3 RX2.3 RX1.3 39.37,21.27 41.59,23.5 51.44,23.5 53.02,25.08 53.02,30.16 50.16,33.02 IC3.6
N$17
  Top 1.016: C2.+ 67.94,10.79 66.36,12.38 IC6.3 64.77,15.24 64.14,15.88 SEL.1
N$44
  Top 0.254: IC2.23 18.39,19.03 20.95,21.59 TX.C
N$45
  Top 0.254: IC2.22 19.04,18.41 20.32,19.68 RX.C
N$47
  Top 0.254: R4.1 61.81,4.13 ON.A
RESET
  Top 0.254: ISP.5 8.57,38.73 SW1.1 | IC1.4 26.66,43.17 25.4,41.91 16.51,41.91 15.24,40.64 SW1.1 | SW1.1 13.97,32.06 10.16,35.88 R1.1 | J1.P$2 25.72,27.62 23.5,29.84 19.68,29.84 17.46,32.07 SW1.1
RPWM  (via drill 0.61)
  Top 0.254: IC1.16 41.43,50 41.91,50.48 v45.09,50.48
  Bottom 0.254: U$1.P$12 45.72,51.12 v45.09,50.48
RST  (via drill 0.61)
  Top 0.254: IC2.2 15.79,11.51 v15.24,12.06 | v12.06,20.95 9.84,23.18 9.84,26.04 13.65,29.84 16.61,29.84 C7.1
  Bottom 0.254: v15.24,12.06 13.97,13.34 13.97,19.05 v12.06,20.95
RX0  (via drill 0.61)
  Top 0.254: XB1.2 13,3.79 15.14,5.93 IC2.1 15.14,10.57 14.29,11.43 14.29,12.38 14.92,13.02 22.54,13.02 v24.77,15.24 | IC1.9 30.66,41.41 33.34,38.73 33.34,23.81 v27.94,18.41
  Bottom 0.254: v24.77,15.24 v27.94,18.41
RX1  (via drill 0.61)
  Top 0.254: IC3.1 47.62,26.99 46.99,26.35 42.86,26.35 42.23,26.99 IC4.6 42.23,29.84 42.55,30.16 44.77,30.16 46.04,31.43 46.04,36.2 45.09,37.15 R2.1 44.13,40.32 v43.18,40.32 | IC1.11 32.26,42.04 v33.97,40.32
  Bottom 0.254: v43.18,40.32 v33.97,40.32
RX_WR  (via drill 0.61)
  Top 0.254: IC3.3 IC3.2 v48.9,31.75 | IC1.25 30.66,57.65 31.11,58.1 33.97,58.1 v34.92,57.15 | v49.53,36.83 v49.53,43.5 | v49.53,49.21 49.53,49.85 47.94,51.44 v40.64,51.44
  Bottom 0.254: v48.9,31.75 48.9,36.2 v49.53,36.83 | v49.53,43.5 v49.53,49.21 | v40.64,51.44 v34.92,57.15
SCK  (via drill 0.61)
  Top 0.254: IC1.3 25.86,43.64 24.77,42.55 9.53,42.55 8.89,43.18 | v7.62,40.01 8.89,41.27 8.89,43.18 | 8.89,43.18 U$6.P$8
  Bottom 0.254: ISP.3 7.62,38.1 v7.62,40.01
SCL
  Top 0.254: IC1.19 49.2,52.4 64.14,37.47 I2C.2
SDA
  Top 0.254: IC1.20 50.94,53.2 62.23,41.91 66.04,41.91 67.31,40.64 67.31,36.2 66.04,34.92 I2C.3
SERVOA  (via drill 0.61)
  Top 0.254: SERVOS.1 54.29,38.73 v52.07,40.96 | IC1.13 47.65,47.6 49.21,46.04 v50.8,46.04
  Bottom 0.254: v52.07,40.96 50.8,42.23 v50.8,46.04
SERVOB  (via drill 0.61)
  Top 0.254: SERVOS.2 56.83,38.73 v53.98,41.59 | IC1.14 48.12,48.4 48.58,47.94 | v52.39,47.31 49.21,47.31 48.58,47.94 | 48.58,47.94 | 48.58,47.94 48.42,48.1
  Bottom 0.254: v53.98,41.59 52.39,43.18 v52.39,47.31
TX0  (via drill 0.61)
  Top 0.254: XB1.3 15,3.89 17.74,6.63 IC2.5 17.74,11.71 18.41,12.38 23.81,12.38 v26.04,14.61 | IC1.10 31.46,41.57 33.97,39.05 33.97,22.54 v28.57,17.14
  Bottom 0.254: v26.04,14.61 v28.57,17.14
TX1  (via drill 0.61)
  Top 0.254: IC3.4 51.44,25.72 50.48,24.77 37.15,24.77 | 37.15,24.77 IC4.2 | v36.51,43.5 36.51,40.32 34.61,38.42 34.61,27.3 37.15,24.77 | v36.51,46.04 35.75,46.8 IC1.12
  Bottom 0.254: v36.51,43.5 v36.51,46.04
USB5V  (via drill 0.61)
  Top 0.406: SEL.3 59.05,7.62 34.92,7.62 33.02,9.53 33.02,17.78 v32.38,18.41 | X1.1 10.49,15.57 17.78,22.86 27.94,22.86 v28.57,22.23
  Bottom 0.406: v28.57,22.23 v32.38,18.41

### Text on the board
Bottom: COPYR 2010 | VANADIUM LABS LLC | REV.A
tPlace: A | B
tNames: D3 | D18 | D2 | LPWM | GND | 5V | GND | RPWM | D1 | D19 | D3 | www.vanadiumlabs.com | A0 | D0 | A1 | D1 | A2 | D2 | A3 | ArbotiX2 | D3 | A4 | robocontroller | D4 | A5 | D5 | A6 | D6(LA) | A7 | D7(LB) | IC5 | D21(RB) | D20(RA) | 3V3 | VIN | VSEL | USB | + | +